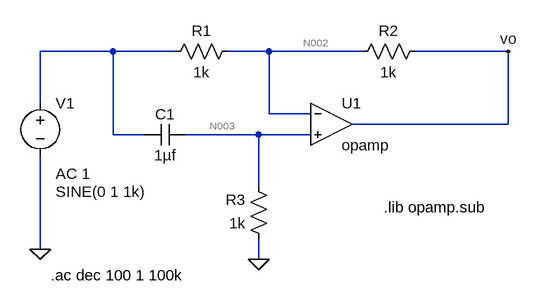
[diagram p0: schematic PasaTodo.asc]
PasaTodo.asc, the LTspice schematic file:
Version 4
SHEET 1 880 680
WIRE -224 64 -336 64
WIRE -128 64 -224 64
WIRE 16 64 -48 64
WIRE 160 64 16 64
WIRE 384 64 240 64
WIRE -336 144 -336 64
WIRE 16 160 16 64
WIRE 80 160 16 160
WIRE 384 176 384 64
WIRE 384 176 144 176
WIRE -224 192 -224 64
WIRE -176 192 -224 192
WIRE 0 192 -112 192
WIRE 80 192 0 192
WIRE 0 272 0 192
WIRE -336 368 -336 224
WIRE 0 384 0 352
FLAG 0 384 0
FLAG -336 368 0
FLAG 384 64 vo
SYMBOL res -32 48 R90
WINDOW 0 0 56 VBottom 2
WINDOW 3 32 56 VTop 2
SYMATTR InstName R1
SYMATTR Value 1k
SYMBOL res 256 48 R90
WINDOW 0 0 56 VBottom 2
WINDOW 3 32 56 VTop 2
SYMATTR InstName R2
SYMATTR Value 1k
SYMBOL res 16 368 R180
WINDOW 0 36 76 Left 2
WINDOW 3 36 40 Left 2
SYMATTR InstName R3
SYMATTR Value 1k
SYMBOL cap -112 176 R90
WINDOW 0 0 32 VBottom 2
WINDOW 3 32 32 VTop 2
SYMATTR InstName C1
SYMATTR Value 1µf
SYMBOL voltage -336 128 R0
WINDOW 3 24 152 Left 2
WINDOW 123 24 124 Left 2
WINDOW 39 0 0 Left 0
SYMATTR Value SINE(0 1 1k)
SYMATTR Value2 AC 1
SYMATTR InstName V1
SYMBOL OpAmps\\opamp 112 112 R0
SYMATTR InstName U1
TEXT -320 408 Left 2 !.ac dec 100 1 100k
TEXT 192 304 Left 2 !.lib opamp.sub

The netlist it stands for:
* PasaTodo.asc
R1 N002 N001 1k
R2 vo N002 1k
R3 0 N003 1k
C1 N003 N001 1µf
V1 N001 0 SINE(0 1 1k) AC 1
XU1 N002 N003 vo opamp Aol=100K GBW=10Meg  ; pins invin noninvin out
.ac dec 100 1 100k
.lib opamp.sub
.backanno
.end

* Results of the author's LTspice run, read from the files saved beside the schematic
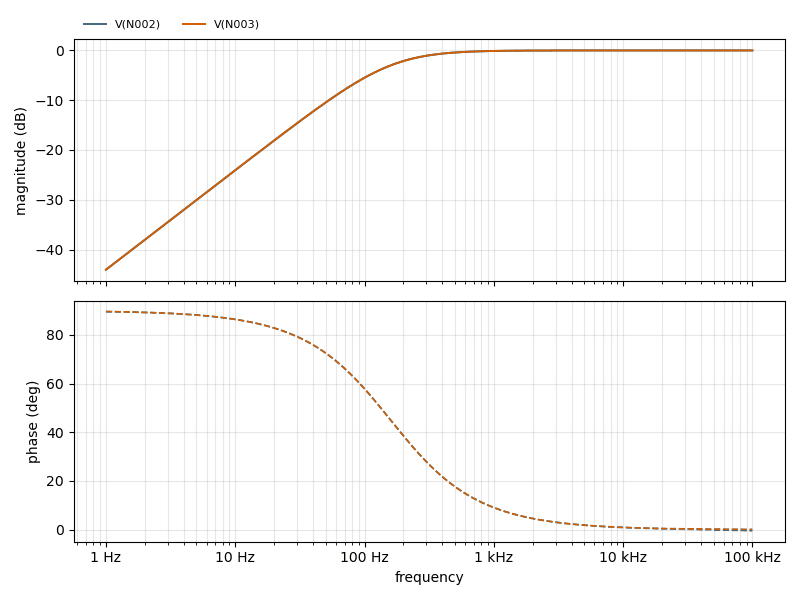
[diagram p1: AC Analysis of PasaTodo.asc, plotted from the saved traces]
* AC Analysis, 1 run:
*   V(N002): -44.04 dB at 1 Hz, -0.00 dB at 100 kHz, peak -0.00 dB at 30.2 kHz, 3 dB below the peak at 159.2 Hz
*   V(N003): -44.04 dB at 1 Hz, -0.00 dB at 100 kHz, peak -0.00 dB at 100 kHz, 3 dB below the peak at 159.2 Hz